# Altium project NBP13 Xilinx CoolRunner-II PQ208 Rev1.01.PrjPcb
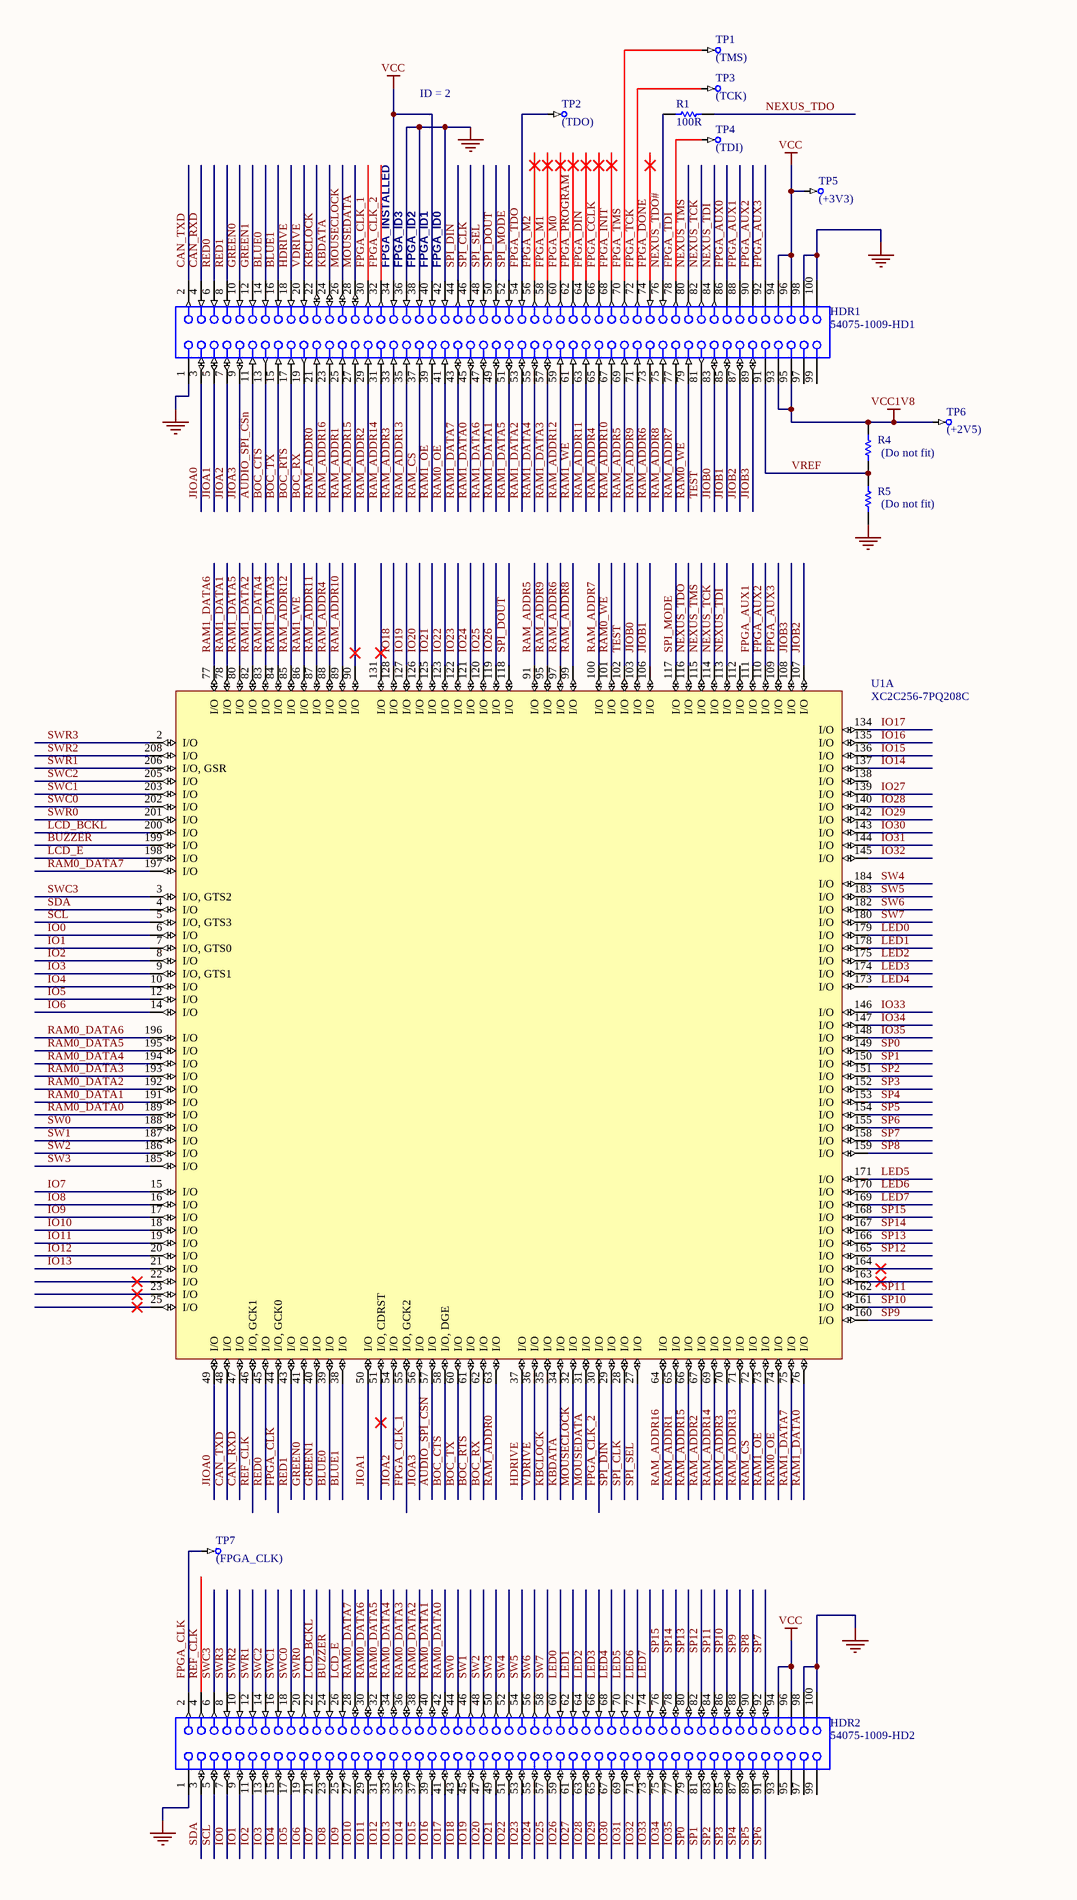
[diagram p0: NBP13 Xilinx CoolRunner-II PQ208 Rev1.01.SchDoc, left]
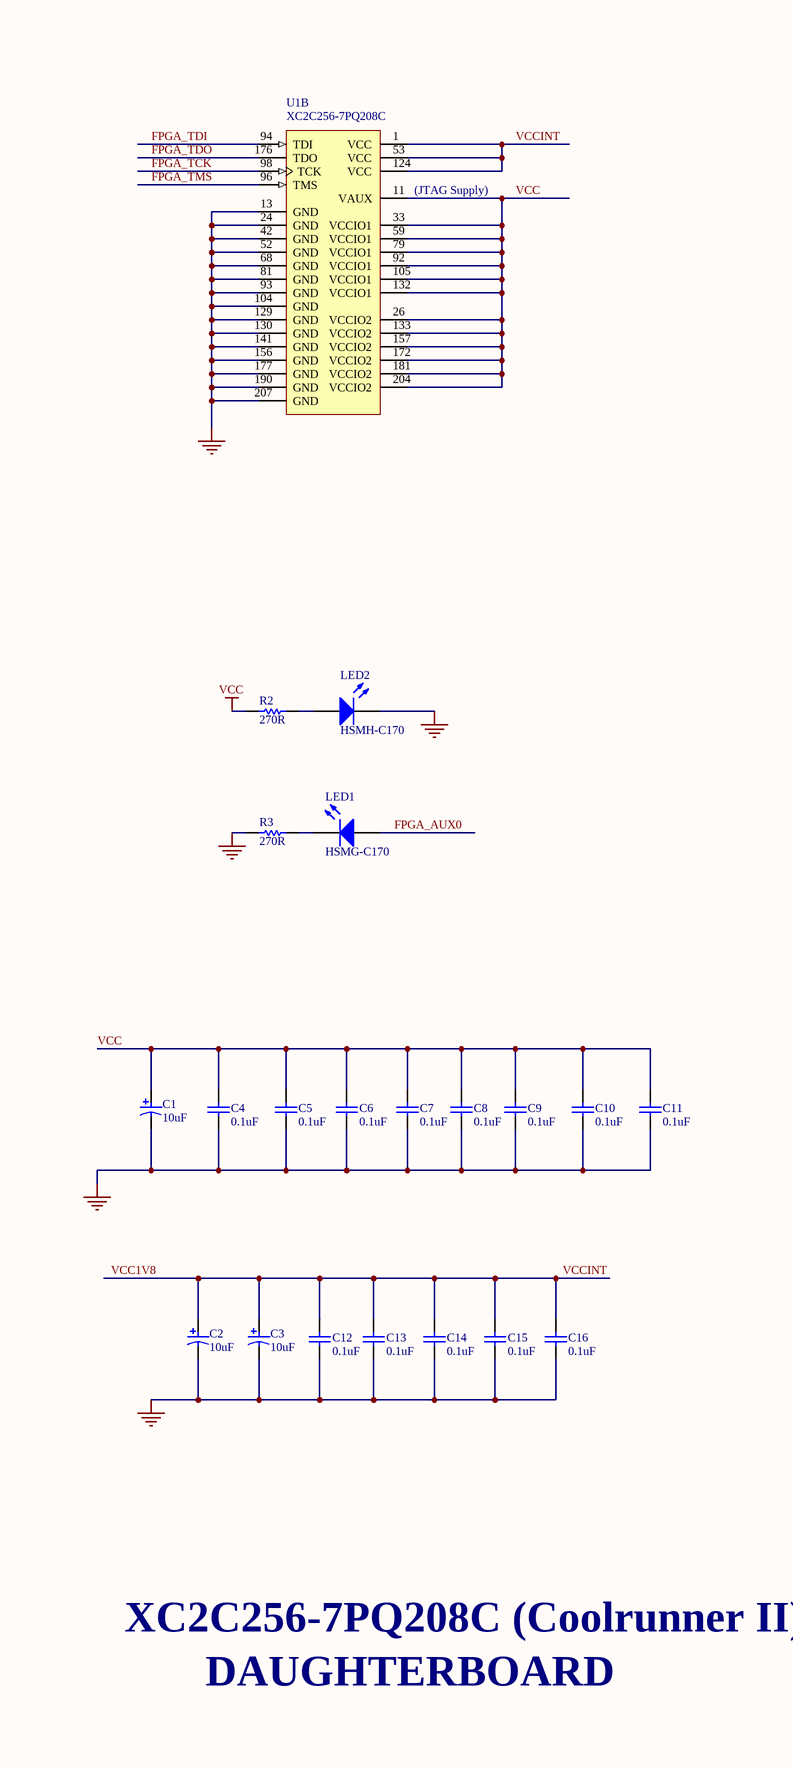
[diagram p1: NBP13 Xilinx CoolRunner-II PQ208 Rev1.01.SchDoc, right]
1 sheet, 33 parts. Net scope: global (net labels, ports and power ports of the same name join across sheets).
Board file: NBP13 Xilinx CoolRunner-II PQ208 Rev1.01.PcbDoc

## Sheet NBP13 Xilinx CoolRunner-II PQ208 Rev1.01.SchDoc: CoolRunner II Daughter Board
size A2; Organization: Altium Limited; Address1: L3, 12a Rodborough Rd; Address2: Frenchs Forest; Address3: NSW; Address4: Australia 2086; DocumentNumber: 1; Revision: 1.01; SheetNumber: 1; SheetTotal: 1

### Parts
C1  10uF  [MCCT-B]
C2  10uF  [MCCT-B]
C3  10uF  [MCCT-B]
C4  0.1uF  [CC2012-0805]
C5  0.1uF  [CC2012-0805]
C6  0.1uF  [CC2012-0805]
C7  0.1uF  [CC2012-0805]
C8  0.1uF  [CC2012-0805]
C9  0.1uF  [CC2012-0805]
C10  0.1uF  [CC2012-0805]
C11  0.1uF  [CC2012-0805]
C12  0.1uF  [CC2012-0805]
C13  0.1uF  [CC2012-0805]
C14  0.1uF  [CC2012-0805]
C15  0.1uF  [CC2012-0805]
C16  0.1uF  [CC2012-0805]
HDR1  54075-1009-HD1  [54075]
HDR2  54075-1009-HD2  [54075]
LED1  HSMG-C170  [SMD _LED]
LED2  HSMH-C170  [SMD _LED]
R1  100R  [CC2012-0805]
R2  270R  [CC2012-0805]
R3  270R  [CC2012-0805]
R4  (Do not fit)  [CC2012-0805]
R5  (Do not fit)  [CC2012-0805]
TP1  (TMS)  [TestPin]  (no BOM)
TP2  (TDO)  [TestPin]  (no BOM)
TP3  (TCK)  [TestPin]  (no BOM)
TP4  (TDI)  [TestPin]  (no BOM)
TP5  (+3V3)  [TestPin]  (no BOM)
TP6  (+2V5)  [TestPin]  (no BOM)
TP7  (FPGA_CLK)  [TestPin]  (no BOM)
U1  XC2C256-7PQ208C  [PQ208]  (parts A,B of 2)

### Nets
GND: C1.2 C2.2 C3.2 C4.2 C5.2 C6.2 C7.2 C8.2 C9.2 C10.2 C11.2 C12.2 C13.2 C14.2 C15.2 C16.2 HDR1.1 HDR1.36 HDR1.38 HDR1.42 HDR1.98 HDR1.100 HDR2.1 HDR2.98 HDR2.100 LED2.2(K) R3.1 R5.2 U1.13(GND) U1.24(GND) U1.42(GND) U1.52(GND) U1.68(GND) U1.81(GND) U1.93(GND) U1.104(GND) U1.129(GND) U1.130(GND) U1.141(GND) U1.156(GND) U1.177(GND) U1.190(GND) U1.207(GND)
VCC: C1.1 C4.1 C5.1 C6.1 C7.1 C8.1 C9.1 C10.1 C11.1 HDR1.34 HDR1.40 HDR1.94 HDR1.96 HDR2.94 HDR2.96 R2.1 TP5.1 U1.11(VAUX) U1.26(VCCIO2) U1.33(VCCIO1) U1.59(VCCIO1) U1.79(VCCIO1) U1.92(VCCIO1) U1.105(VCCIO1) U1.132(VCCIO1) U1.133(VCCIO2) U1.157(VCCIO2) U1.172(VCCIO2) U1.181(VCCIO2) U1.204(VCCIO2)
VCC1V8: C2.1 C3.1 C12.1 C13.1 C14.1 C15.1 C16.1 HDR1.93 HDR1.95 R4.1 TP6.1 U1.1(VCC) U1.53(VCC) U1.124(VCC)  [also labelled VCCINT]
AUDIO_SPI_CSn: HDR1.11 U1.57(I/O)
BLUE0: HDR1.14 U1.39(I/O)
BLUE1: HDR1.16 U1.38(I/O)
BOC_CTS: HDR1.13 U1.58(I/O,_DGE)
BOC_RTS: HDR1.17 U1.61(I/O)
BOC_RX: HDR1.19 U1.62(I/O)
BOC_TX: HDR1.15 U1.60(I/O)
BUZZER: HDR2.24 U1.199(I/O)
CAN_RXD: HDR1.4 U1.47(I/O)
CAN_TXD: HDR1.2 U1.48(I/O)
FPGA_AUX0: HDR1.86 LED1.1(A)
FPGA_AUX1: HDR1.88 U1.111(I/O)
FPGA_AUX2: HDR1.90 U1.110(I/O)
FPGA_AUX3: HDR1.92 U1.109(I/O)
FPGA_CCLK: HDR1.66
FPGA_CLK: HDR2.2 TP7.1 U1.44(I/O,_GCK0)
FPGA_CLK_1: HDR1.30 U1.55(I/O,_GCK2)
FPGA_CLK_2: HDR1.32 U1.30(I/O)
FPGA_DIN: HDR1.64
FPGA_DONE: HDR1.74
FPGA_INIT: HDR1.68
FPGA_M0: HDR1.60
FPGA_M1: HDR1.58
FPGA_M2: HDR1.56
FPGA_PROGRAM: HDR1.62
FPGA_TCK: HDR1.72 TP3.1 U1.98(TCK)
FPGA_TDI: HDR1.78 TP4.1 U1.94(TDI)
FPGA_TDO: HDR1.54 TP2.1 U1.176(TDO)
FPGA_TMS: HDR1.70 TP1.1 U1.96(TMS)
GREEN0: HDR1.10 U1.41(I/O)
GREEN1: HDR1.12 U1.40(I/O)
HDRIVE: HDR1.18 U1.37(I/O)
IO0: HDR2.7 U1.6(I/O)
IO1: HDR2.9 U1.7(I/O,_GTS0)
IO2: HDR2.11 U1.8(I/O)
IO3: HDR2.13 U1.9(I/O,_GTS1)
IO4: HDR2.15 U1.10(I/O)
IO5: HDR2.17 U1.12(I/O)
IO6: HDR2.19 U1.14(I/O)
IO7: HDR2.21 U1.15(I/O)
IO8: HDR2.23 U1.16(I/O)
IO9: HDR2.25 U1.17(I/O)
IO10: HDR2.27 U1.18(I/O)
IO11: HDR2.29 U1.19(I/O)
IO12: HDR2.31 U1.20(I/O)
IO13: HDR2.33 U1.21(I/O)
IO14: HDR2.35 U1.137(I/O)
IO15: HDR2.37 U1.136(I/O)
IO16: HDR2.39 U1.135(I/O)
IO17: HDR2.41 U1.134(I/O)
IO18: HDR2.43 U1.128(I/O)
IO19: HDR2.45 U1.127(I/O)
IO20: HDR2.47 U1.126(I/O)
IO21: HDR2.49 U1.125(I/O)
IO22: HDR2.51 U1.123(I/O)
IO23: HDR2.53 U1.122(I/O)
IO24: HDR2.55 U1.121(I/O)
IO25: HDR2.57 U1.120(I/O)
IO26: HDR2.59 U1.119(I/O)
IO27: HDR2.61 U1.139(I/O)
IO28: HDR2.63 U1.140(I/O)
IO29: HDR2.65 U1.142(I/O)
IO30: HDR2.67 U1.143(I/O)
IO31: HDR2.69 U1.144(I/O)
IO32: HDR2.71 U1.145(I/O)
IO33: HDR2.73 U1.146(I/O)
IO34: HDR2.75 U1.147(I/O)
IO35: HDR2.77 U1.148(I/O)
JIOA0: HDR1.3 U1.49(I/O)
JIOA1: HDR1.5 U1.50(I/O)
JIOA2: HDR1.7 U1.54(I/O)
JIOA3: HDR1.9 U1.56(I/O)
JIOB0: HDR1.83 U1.103(I/O)
JIOB1: HDR1.85 U1.106(I/O)
JIOB2: HDR1.87 U1.107(I/O)
JIOB3: HDR1.89 U1.108(I/O)
KBCLOCK: HDR1.22 U1.35(I/O)
KBDATA: HDR1.24 U1.34(I/O)
LCD_BCKL: HDR2.22 U1.200(I/O)
LCD_E: HDR2.26 U1.198(I/O)
LED0: HDR2.60 U1.179(I/O)
LED1: HDR2.62 U1.178(I/O)
LED2: HDR2.64 U1.175(I/O)
LED3: HDR2.66 U1.174(I/O)
LED4: HDR2.68 U1.173(I/O)
LED5: HDR2.70 U1.171(I/O)
LED6: HDR2.72 U1.170(I/O)
LED7: HDR2.74 U1.169(I/O)
MOUSECLOCK: HDR1.26 U1.32(I/O)
MOUSEDATA: HDR1.28 U1.31(I/O)
NEXUS_TCK: HDR1.82 U1.114(I/O)
NEXUS_TDI: HDR1.84 U1.113(I/O)
NEXUS_TDO: R1.2 U1.116(I/O)
NEXUS_TDO#: HDR1.76 R1.1
NEXUS_TMS: HDR1.80 U1.115(I/O)
RAM0_DATA0: HDR2.42 U1.189(I/O)
RAM0_DATA1: HDR2.40 U1.191(I/O)
RAM0_DATA2: HDR2.38 U1.192(I/O)
RAM0_DATA3: HDR2.36 U1.193(I/O)
RAM0_DATA4: HDR2.34 U1.194(I/O)
RAM0_DATA5: HDR2.32 U1.195(I/O)
RAM0_DATA6: HDR2.30 U1.196(I/O)
RAM0_DATA7: HDR2.28 U1.197(I/O)
RAM0_OE: HDR1.41 U1.74(I/O)
RAM0_WE: HDR1.79 U1.101(I/O)
RAM1_DATA0: HDR1.45 U1.76(I/O)
RAM1_DATA1: HDR1.49 U1.78(I/O)
RAM1_DATA2: HDR1.53 U1.82(I/O)
RAM1_DATA3: HDR1.57 U1.84(I/O)
RAM1_DATA4: HDR1.55 U1.83(I/O)
RAM1_DATA5: HDR1.51 U1.80(I/O)
RAM1_DATA6: HDR1.47 U1.77(I/O)
RAM1_DATA7: HDR1.43 U1.75(I/O)
RAM1_OE: HDR1.39 U1.73(I/O)
RAM1_WE: HDR1.61 U1.86(I/O)
RAM_ADDR0: HDR1.21 U1.63(I/O)
RAM_ADDR1: HDR1.25 U1.65(I/O)
RAM_ADDR2: HDR1.29 U1.67(I/O)
RAM_ADDR3: HDR1.33 U1.70(I/O)
RAM_ADDR4: HDR1.65 U1.88(I/O)
RAM_ADDR5: HDR1.69 U1.91(I/O)
RAM_ADDR6: HDR1.73 U1.97(I/O)
RAM_ADDR7: HDR1.77 U1.100(I/O)
RAM_ADDR8: HDR1.75 U1.99(I/O)
RAM_ADDR9: HDR1.71 U1.95(I/O)
RAM_ADDR10: HDR1.67 U1.89(I/O)
RAM_ADDR11: HDR1.63 U1.87(I/O)
RAM_ADDR12: HDR1.59 U1.85(I/O)
RAM_ADDR13: HDR1.35 U1.71(I/O)
RAM_ADDR14: HDR1.31 U1.69(I/O)
RAM_ADDR15: HDR1.27 U1.66(I/O)
RAM_ADDR16: HDR1.23 U1.64(I/O)
RAM_CS: HDR1.37 U1.72(I/O)
RED0: HDR1.6 U1.45(I/O)
RED1: HDR1.8 U1.43(I/O)
REF_CLK: HDR2.4 U1.46(I/O,_GCK1)
SCL: HDR2.5 U1.5(I/O,_GTS3)
SDA: HDR2.3 U1.4(I/O)
SP0: HDR2.79 U1.149(I/O)
SP1: HDR2.81 U1.150(I/O)
SP2: HDR2.83 U1.151(I/O)
SP3: HDR2.85 U1.152(I/O)
SP4: HDR2.87 U1.153(I/O)
SP5: HDR2.89 U1.154(I/O)
SP6: HDR2.91 U1.155(I/O)
SP7: HDR2.92 U1.158(I/O)
SP8: HDR2.90 U1.159(I/O)
SP9: HDR2.88 U1.160(I/O)
SP10: HDR2.86 U1.161(I/O)
SP11: HDR2.84 U1.162(I/O)
SP12: HDR2.82 U1.165(I/O)
SP13: HDR2.80 U1.166(I/O)
SP14: HDR2.78 U1.167(I/O)
SP15: HDR2.76 U1.168(I/O)
SPI_CLK: HDR1.46 U1.28(I/O)
SPI_DIN: HDR1.44 U1.29(I/O)
SPI_DOUT: HDR1.50 U1.118(I/O)
SPI_MODE: HDR1.52 U1.117(I/O)
SPI_SEL: HDR1.48 U1.27(I/O)
SW0: HDR2.44 U1.188(I/O)
SW1: HDR2.46 U1.187(I/O)
SW2: HDR2.48 U1.186(I/O)
SW3: HDR2.50 U1.185(I/O)
SW4: HDR2.52 U1.184(I/O)
SW5: HDR2.54 U1.183(I/O)
SW6: HDR2.56 U1.182(I/O)
SW7: HDR2.58 U1.180(I/O)
SWC0: HDR2.18 U1.202(I/O)
SWC1: HDR2.16 U1.203(I/O)
SWC2: HDR2.14 U1.205(I/O)
SWC3: HDR2.6 U1.3(I/O,_GTS2)
SWR0: HDR2.20 U1.201(I/O)
SWR1: HDR2.12 U1.206(I/O,_GSR)
SWR2: HDR2.10 U1.208(I/O)
SWR3: HDR2.8 U1.2(I/O)
TEST: HDR1.81 U1.102(I/O)
VDRIVE: HDR1.20 U1.36(I/O)
VREF: HDR1.91 R4.2 R5.1
NetLED1_2: LED1.2(K) R3.2
NetLED2_1: LED2.1(A) R2.2

Not connected (* = marked no-connect by the designer): HDR1 97 99; HDR2 93 95 97 99; U1 22(I/O)* 23(I/O)* 25(I/O)* 51(I/O,_CDRST)* 90(I/O)* 112(I/O) 131(I/O)* 138(I/O) 163(I/O)* 164(I/O)*

### Notes on the sheet
- ID = 2
- (near HDR1) FPGA_INSTALLED
- (near HDR1) FPGA_ID3
- (near HDR1) FPGA_ID2
- (near HDR1) FPGA_ID1
- (near HDR1) FPGA_ID0
- (near U1) (JTAG Supply)
- XC2C256-7PQ208C (Coolrunner II)
- DAUGHTERBOARD
- Title
- Size:
- Date:
- File:
- A2
- Number:
- Time:
- Revision:
- Sheet
- of

### Library data of the parts
C1-C3 = CAP_POLAR: Polar Capacitor; Supplier: FARNELL; Supplier Code: 967-117
C4-C16 = CAP: Capacitor; Supplier: FARNELL; Supplier Code: 499-687
HDR1 = 54075-1009-HD1: Board-to-Board, Docking Station, 0.80mm (.031") Pitch, Shielded Receptacle, Vertical, Ultra Low Profile, SMT; Manufacturer: Molex; Package Information: Latest Revision: Jun-2001; Mating Height: 8.5mm; Voltage: 100V; Current: 0.5A; Contact Resistance: 40mOhm max; PCB Layout: Complies with Manufacturer's Recommendation.; Published: 15-Oct-2003; Datasheet: Latest Revision: Feb-2002; Package Reference: 54075; Publisher: Altium Limited
HDR2 = 54075-1009-HD2: Board-to-Board, Docking Station, 0.80mm (.031") Pitch, Shielded Receptacle, Vertical, Ultra Low Profile, SMT; Manufacturer: Molex; Package Information: Latest Revision: Jun-2001; Mating Height: 8.5mm; Voltage: 100V; Current: 0.5A; Contact Resistance: 40mOhm max; PCB Layout: Complies with Manufacturer's Recommendation.; Published: 15-Oct-2003; Datasheet: Latest Revision: Feb-2002; Package Reference: 54075; Publisher: Altium Limited
LED1 LED2 = HSMX-C670: Typical RED GaAs SMD LED Agilent make; Manufacturer: Generic Components; Class I: Optoelectronic; Fitted: True; Published: 8-Jun-2000; Revision: July-2002: Re-released for DXP Platform.; Publisher: Altium Limited; Class II: LED
R1-R5 = RES: Resistor
TP1-TP7 = TestPin
U1 = XC2C256-7PQ208C: CoolRunner-II 256 Macrocell CPLD, 208-Pin PQFP, Commercial Grade; Package Information: Latest Revision: ver1.1, Oct-2002; Code - JEDEC: MS-029-FA-1; Published: 23-Sep-2002; Datasheet: Latest Revision: ver2.1, Apr-2003; Package Reference: PQ208; Publisher: Altium Limited